# EAGLE board Eagle_LEDCUBE2 (EAGLE 6.5.0)
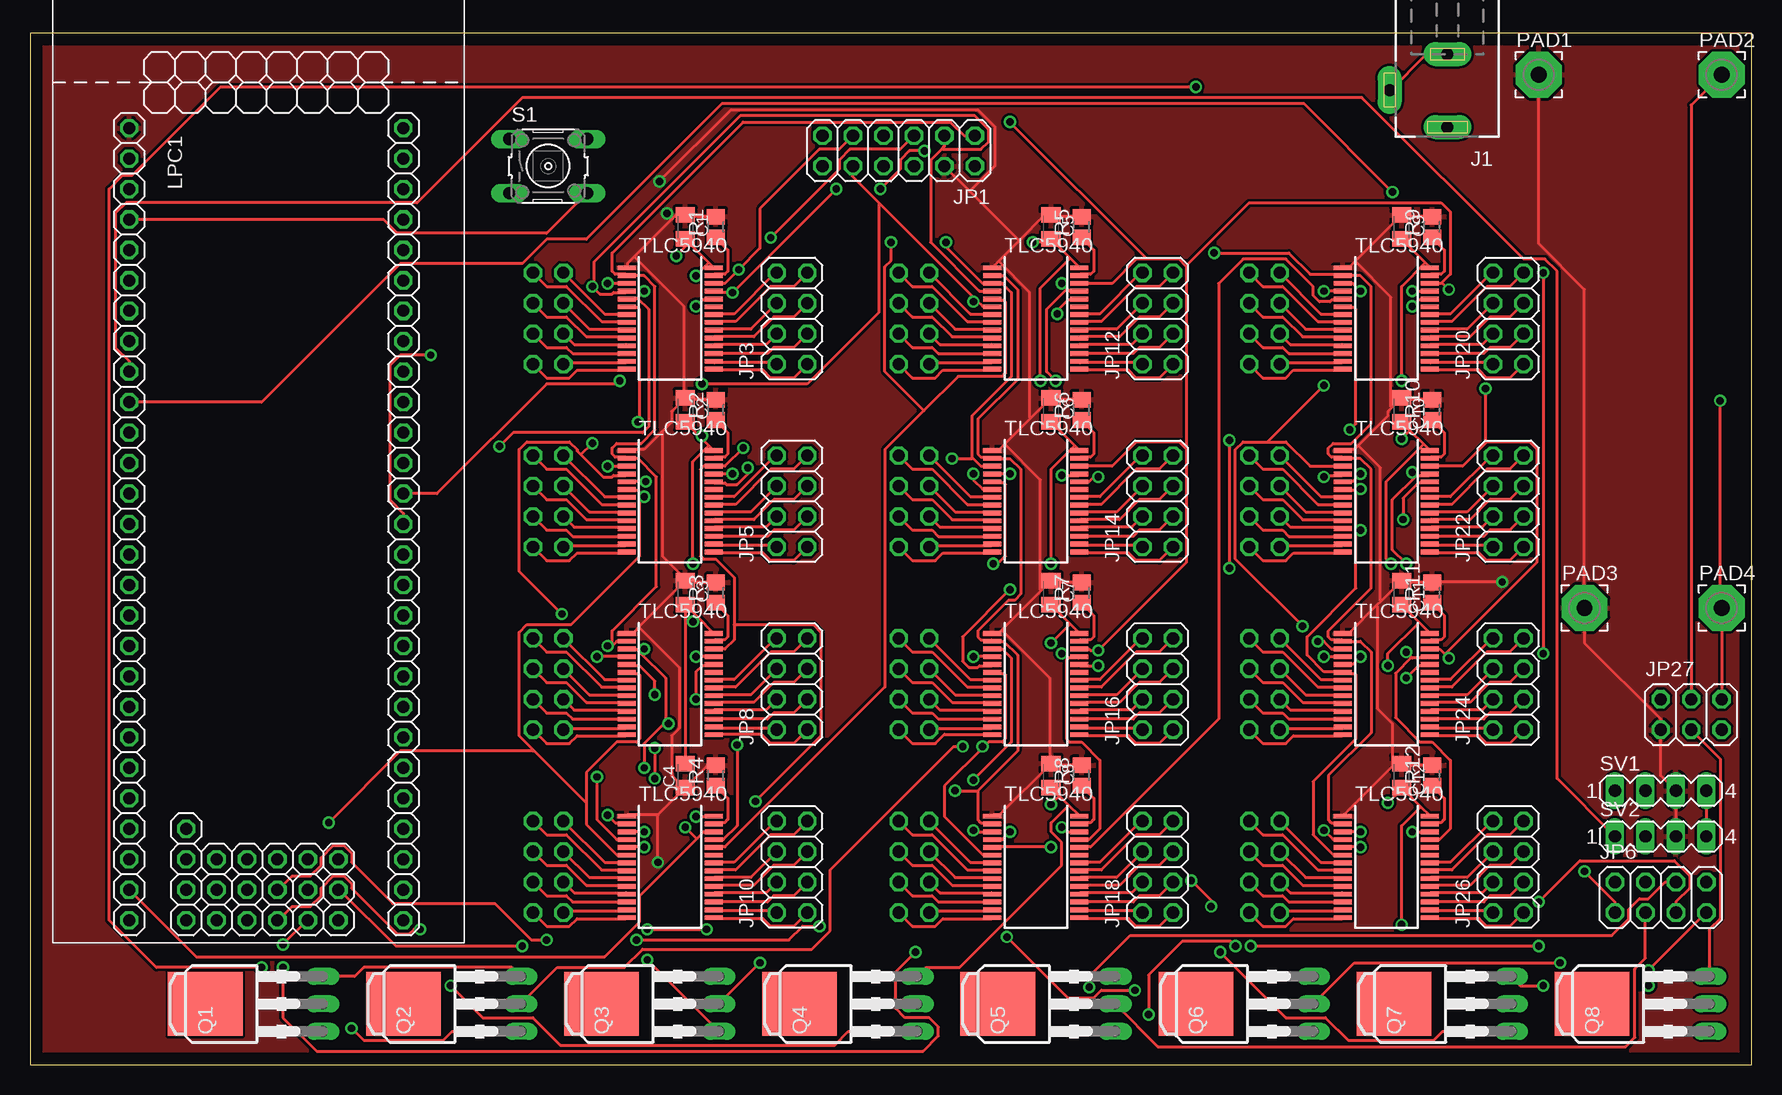
[diagram p6: board, top side]
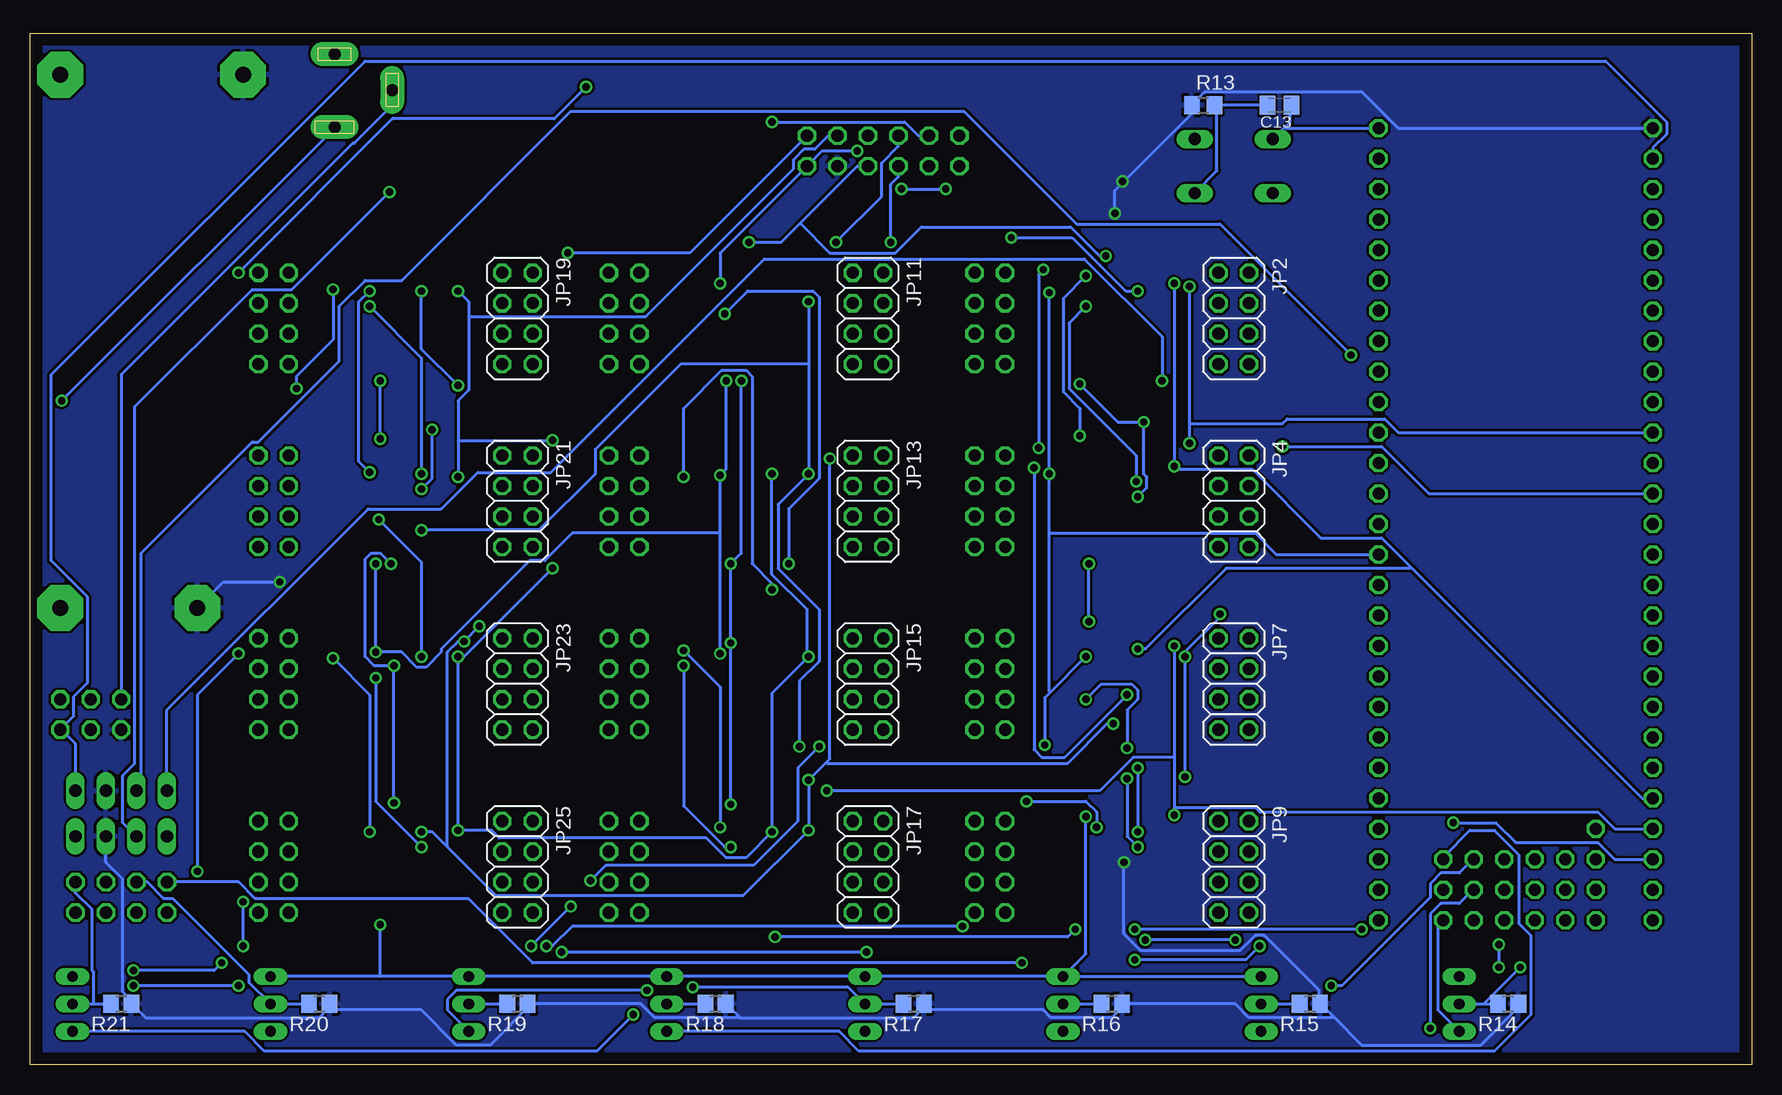
[diagram p7: board, bottom side, seen from below]

Size 143.49 x 86.03 mm. Coordinates in mm from the lower left corner, seen from the top.
Outline: 0,0 143.49,0 143.49,86.03 0,86.03 0,0
Copper layers (1*16): Top 0.035mm / dielectric 1.5mm / Bottom 0.035mm
Design rules "default": minimum track width 10mil, minimum drill 24mil, track to track 8mil, track to pad 8mil, pad to pad 8mil, via to via 8mil, smd to smd 8mil, copper to edge 40mil, drill to drill 8mil, minimum pad ring 10mil, minimum via ring 8mil, stop-mask expansion 4mil, vias tented up to drill 0mil, thermal gap 10mil

## Footprints (pad centres in the part's own frame; a part is rotated, then mirrored left to right if it is on the bottom)
C0805K = smd 1.3 x 1.6: 1 -1,0; 2 1,0
IC-SSOP28 = smd 0.4 x 1.5: 1 -4.225,-3.625; 2 -3.575,-3.625; 3 -2.925,-3.625; 4 -2.275,-3.625; 5 -1.625,-3.625; 6 -0.975,-3.625; 7 -0.325,-3.625; 8 0.325,-3.625; 9 0.975,-3.625; 10 1.625,-3.625; 11 2.275,-3.625; 12 2.925,-3.625; 13 3.575,-3.625; 14 4.225,-3.625; 15 4.225,3.625; 16 3.575,3.625; 17 2.925,3.625; 18 2.275,3.625; 19 1.625,3.625; 20 0.975,3.625; 21 0.325,3.625; 22 -0.325,3.625; 23 -0.975,3.625; 24 -1.625,3.625; 25 -2.275,3.625; 26 -2.925,3.625; 27 -3.575,3.625; 28 -4.225,3.625
DCJ0202 = drill 1 pad 2 long: 1 0,3.1; 2 4.8,0; 3 0,-3
2X06 = drill 1.016 octagon: 1 -6.35,-1.27; 2 -6.35,1.27; 3 -3.81,-1.27; 4 -3.81,1.27; 5 -1.27,-1.27; 6 -1.27,1.27; 7 1.27,-1.27; 8 1.27,1.27; 9 3.81,-1.27; 10 3.81,1.27; 11 6.35,-1.27; 12 6.35,1.27
2X04 = drill 1.016 octagon: 1 -3.81,-1.27; 2 -3.81,1.27; 3 -1.27,-1.27; 4 -1.27,1.27; 5 1.27,-1.27; 6 1.27,1.27; 7 3.81,-1.27; 8 3.81,1.27
2X03 = drill 1.016 octagon: 1 -2.54,-1.27; 2 -2.54,1.27; 3 0,-1.27; 4 0,1.27; 5 2.54,-1.27; 6 2.54,1.27
LPCXPRESSO_LPC1769 = drill 1 octagon: 1 33.655,-5.715; 2 36.195,-5.715; 3 38.735,-5.715; 4 41.275,-5.715; 5 43.815,-5.715; 6 46.355,-5.715; 7 48.895,-5.715; 8 51.435,-5.715; 9 53.975,-5.715; 10 56.515,-5.715; 11 59.055,-5.715; 12 61.595,-5.715; 13 64.135,-5.715; 14 66.675,-5.715; 15 69.215,-5.715; 16 71.755,-5.715; 17 74.295,-5.715; 18 76.835,-5.715; 19 79.375,-5.715; 20 81.915,-5.715; 21 84.455,-5.715; 22 86.995,-5.715; 23 89.535,-5.715; 24 92.075,-5.715; 25 94.615,-5.715; 26 97.155,-5.715; 27 99.695,-5.715; 28 33.655,17.145; 29 36.195,17.145; 30 38.735,17.145; 31 41.275,17.145; 32 43.815,17.145; 33 46.355,17.145; 34 48.895,17.145; 35 51.435,17.145; 36 53.975,17.145; 37 56.515,17.145; 38 59.055,17.145; 39 61.595,17.145; 40 64.135,17.145; 41 66.675,17.145; 42 69.215,17.145; 43 71.755,17.145; 44 74.295,17.145; 45 76.835,17.145; 46 79.375,17.145; 47 81.915,17.145; 48 84.455,17.145; 49 86.995,17.145; 50 89.535,17.145; 51 92.075,17.145; 52 94.615,17.145; 53 97.155,17.145; 54 99.695,17.145; 55 92.075,-0.965; 56 94.615,-0.965; 57 97.155,-0.965; 58 99.695,-0.965; 59 94.615,1.575; 60 97.155,1.575; 61 99.695,1.575; 62 94.615,4.115; 63 97.155,4.115; 64 99.695,4.115; 65 94.615,6.655; 66 97.155,6.655; 67 99.695,6.655; 68 94.615,9.195; 69 97.155,9.195; 70 99.695,9.195; 71 94.615,11.735; 72 97.155,11.735; 73 99.695,11.735
3,81/1,3 = drill 1.321 pad 3.81 octagon: 1 0,0
TO251AA = drill 0.889 long: 1 -2.286,-5.334; 2 0,-5.334; 3 2.286,-5.334 | smd 5.334 x 6.223: 4 0,4.445
R0805 = smd 1.3 x 1.5: 1 -0.85,0; 2 0.85,0
R0805' = smd 1.3 x 1.5: 1 -0.95,0; 2 0.95,0
B3F-10XX = drill 1.016 long: 1 -3.251,2.261; 2 3.251,2.261; 3 -3.251,-2.261; 4 3.251,-2.261
MA04-1 = drill 1.016 long: 1 -3.81,0; 2 -1.27,0; 3 1.27,0; 4 3.81,0

## Placement (x,y rotation side)
C1  [C0805K]  54.61,69.85 270 top
C2  [C0805K]  54.61,54.61 270 top
C3  [C0805K]  54.61,39.37 270 top
C4  [C0805K]  54.61,24.13 90 top
C5  [C0805K]  85.09,69.85 270 top
C6  [C0805K]  85.09,54.61 270 top
C7  [C0805K]  85.09,39.37 270 top
C8  [C0805K]  85.09,24.13 270 top
C9  [C0805K]  114.3,69.85 270 top
C10  [C0805K]  114.3,54.61 270 top
C11  [C0805K]  114.3,39.37 270 top
C12  [C0805K]  114.3,24.13 270 top
C13  [C0805K]  39.37,80.01 180 bottom
IC1  [IC-SSOP28]  53.34,62.23 270 top
IC2  [IC-SSOP28]  53.34,46.99 270 top
IC3  [IC-SSOP28]  53.34,31.75 270 top
IC4  [IC-SSOP28]  53.34,16.51 270 top
IC5  [IC-SSOP28]  83.82,62.23 270 top
IC6  [IC-SSOP28]  83.82,46.99 270 top
IC7  [IC-SSOP28]  83.82,31.75 270 top
IC8  [IC-SSOP28]  83.82,16.51 270 top
IC9  [IC-SSOP28]  113.03,62.23 270 top
IC10  [IC-SSOP28]  113.03,46.99 270 top
IC11  [IC-SSOP28]  113.03,31.75 270 top
IC12  [IC-SSOP28]  113.03,16.51 270 top
J1  DCJ0202  [DCJ0202]  118.11,81.28 180 top
JP1  [2X06]  72.39,76.2 180 top
JP2  [2X04]  43.18,62.23 270 bottom
JP3  [2X04]  63.5,62.23 90 top
JP4  [2X04]  43.18,46.99 270 bottom
JP5  [2X04]  63.5,46.99 90 top
JP6  [2X04]  135.89,13.97 0 top
JP7  [2X04]  43.18,31.75 270 bottom
JP8  [2X04]  63.5,31.75 90 top
JP9  [2X04]  43.18,16.51 270 bottom
JP10  [2X04]  63.5,16.51 90 top
JP11  [2X04]  73.66,62.23 270 bottom
JP12  [2X04]  93.98,62.23 90 top
JP13  [2X04]  73.66,46.99 270 bottom
JP14  [2X04]  93.98,46.99 90 top
JP15  [2X04]  73.66,31.75 270 bottom
JP16  [2X04]  93.98,31.75 90 top
JP17  [2X04]  73.66,16.51 270 bottom
JP18  [2X04]  93.98,16.51 90 top
JP19  [2X04]  102.87,62.23 270 bottom
JP20  [2X04]  123.19,62.23 90 top
JP21  [2X04]  102.87,46.99 270 bottom
JP22  [2X04]  123.19,46.99 90 top
JP23  [2X04]  102.87,31.75 270 bottom
JP24  [2X04]  123.19,31.75 90 top
JP25  [2X04]  102.87,16.51 270 bottom
JP26  [2X04]  123.19,16.51 90 top
JP27  [2X03]  138.43,29.21 0 top
LPC1  [LPCXPRESSO_LPC1769]  13.97,111.76 270 top
PAD1  [3,81/1,3]  125.73,82.55 0 top
PAD2  [3,81/1,3]  140.97,82.55 0 top
PAD3  [3,81/1,3]  129.54,38.1 0 top
PAD4  [3,81/1,3]  140.97,38.1 0 top
Q1  SPD30P06P  [TO251AA]  19.05,5.08 90 top
Q2  SPD30P06P  [TO251AA]  35.56,5.08 90 top
Q3  SPD30P06P  [TO251AA]  52.07,5.08 90 top
Q4  SPD30P06P  [TO251AA]  68.58,5.08 90 top
Q5  SPD30P06P  [TO251AA]  85.09,5.08 90 top
Q6  SPD30P06P  [TO251AA]  101.6,5.08 90 top
Q7  SPD30P06P  [TO251AA]  118.11,5.08 90 top
Q8  SPD30P06P  [TO251AA]  134.62,5.08 90 top
R1  2.2k  [R0805]  57.15,69.85 90 top
R2  2.2k  [R0805]  57.15,54.61 90 top
R3  2.2k  [R0805]  57.15,39.37 90 top
R4  2.2k  [R0805]  57.15,24.13 90 top
R5  2.2k  [R0805]  87.63,69.85 90 top
R6  2.2k  [R0805]  87.63,54.61 90 top
R7  2.2k  [R0805]  87.63,39.37 90 top
R8  2.2k  [R0805]  87.63,24.13 90 top
R9  2.2k  [R0805]  116.84,69.85 90 top
R10  2.2k  [R0805]  116.84,54.61 90 top
R11  2.2k  [R0805]  116.84,39.37 90 top
R12  2.2k  [R0805]  116.84,24.13 90 top
R13  [R0805']  45.72,80.01 0 bottom
R14  [R0805]  20.32,5.08 180 bottom
R15  [R0805]  36.83,5.08 180 bottom
R16  [R0805]  53.34,5.08 180 bottom
R17  [R0805]  69.85,5.08 180 bottom
R18  [R0805]  86.36,5.08 180 bottom
R19  [R0805]  102.87,5.08 180 bottom
R20  [R0805]  119.38,5.08 180 bottom
R21  [R0805]  135.89,5.08 180 bottom
S1  [B3F-10XX]  43.18,74.93 0 top
SV1  [MA04-1]  135.89,22.86 0 top
SV2  [MA04-1]  135.89,19.05 0 top

## Tracks (layer width: path | path; a pad name or v marks a point on that pad's centre or on a via)
2A1
  Top 0.254: JP11.1 78.36,62.61 80.14,62.61 IC5.7
2A2
  Top 0.254: JP11.2 73.53,64.9 75.18,64.9 78.11,61.98 80.14,61.98 IC5.8
2A3
  Top 0.254: JP11.3 77.09,61.34 80.14,61.34 IC5.9
2A4
  Top 0.254: JP11.4 73.53,62.36 75.18,62.36 76.83,60.71 80.14,60.71 IC5.10
2A5
  Top 0.254: JP11.5 75.82,60.07 80.14,60.07 IC5.11
2A6
  Top 0.254: JP11.6 73.53,59.82 75.18,59.82 75.69,59.31 80.14,59.31 IC5.12
2A7
  Top 0.254: JP11.7 75.06,58.55 80.14,58.55 IC5.13
2A8
  Top 0.254: JP11.8 73.53,57.28 75.44,57.28 76.07,57.91 80.14,57.91 IC5.14
2A9
  Top 0.254: JP12.1 94.11,57.28 92.2,57.28 91.57,57.91 87.5,57.91 IC5.15
2A10
  Top 0.254: JP12.2 92.58,58.55 87.5,58.55 IC5.16
2A11
  Top 0.254: JP12.3 94.11,59.82 92.46,59.82 91.95,59.31 87.5,59.31 IC5.17
2A12
  Top 0.254: JP12.4 91.82,60.07 87.5,60.07 IC5.18
2A13
  Top 0.254: JP12.5 94.11,62.36 92.46,62.36 90.8,60.71 87.5,60.71 IC5.19
2A14
  Top 0.254: JP12.6 90.55,61.34 87.5,61.34 IC5.20
2A15
  Top 0.254: JP12.7 94.11,64.9 92.2,64.9 89.28,61.98 87.5,61.98 IC5.21
2A16
  Top 0.254: JP12.8 92.58,66.04 89.15,62.61 87.5,62.61 IC5.22
2B1
  Top 0.254: JP13.1 78.36,47.37 80.14,47.37 IC6.7
2B2
  Top 0.254: JP13.2 73.53,49.66 75.18,49.66 78.11,46.74 80.14,46.74 IC6.8
2B3
  Top 0.254: JP13.3 77.09,46.1 80.14,46.1 IC6.9
2B4
  Top 0.254: JP13.4 73.53,47.12 75.18,47.12 76.83,45.47 80.14,45.47 IC6.10
2B5
  Top 0.254: JP13.5 75.82,44.83 80.14,44.83 IC6.11
2B6
  Top 0.254: JP13.6 73.53,44.58 75.18,44.58 75.69,44.07 80.14,44.07 IC6.12
2B7
  Top 0.254: JP13.7 75.06,43.31 80.14,43.31 IC6.13
2B8
  Top 0.254: JP13.8 73.53,42.04 75.44,42.04 76.07,42.67 80.14,42.67 IC6.14
2B9
  Top 0.254: JP14.1 94.11,42.04 92.2,42.04 91.57,42.67 87.5,42.67 IC6.15
2B10
  Top 0.254: JP14.2 92.58,43.31 87.5,43.31 IC6.16
2B11
  Top 0.254: JP14.3 94.11,44.58 92.46,44.58 91.95,44.07 87.5,44.07 IC6.17
2B12
  Top 0.254: JP14.4 91.82,44.83 87.5,44.83 IC6.18
2B13
  Top 0.254: JP14.5 94.11,47.12 92.46,47.12 90.8,45.47 87.5,45.47 IC6.19
2B14
  Top 0.254: JP14.6 90.55,46.1 87.5,46.1 IC6.20
2B15
  Top 0.254: JP14.7 94.11,49.66 92.2,49.66 89.28,46.74 87.5,46.74 IC6.21
2B16
  Top 0.254: JP14.8 92.58,50.8 89.15,47.37 87.5,47.37 IC6.22
2C1
  Top 0.254: JP15.1 78.36,32.13 80.14,32.13 IC7.7
2C2
  Top 0.254: JP15.2 73.53,34.42 75.18,34.42 78.11,31.5 80.14,31.5 IC7.8
2C3
  Top 0.254: JP15.3 77.09,30.86 80.14,30.86 IC7.9
2C4
  Top 0.254: JP15.4 73.53,31.88 75.18,31.88 76.83,30.23 80.14,30.23 IC7.10
2C5
  Top 0.254: JP15.5 75.82,29.59 80.14,29.59 IC7.11
2C6
  Top 0.254: JP15.6 73.53,29.34 75.18,29.34 75.69,28.83 80.14,28.83 IC7.12
2C7
  Top 0.254: JP15.7 75.06,28.07 80.14,28.07 IC7.13
2C8
  Top 0.254: JP15.8 73.53,26.8 75.44,26.8 76.2,27.56 80.14,27.56 IC7.14
2C9
  Top 0.254: JP16.1 94.11,26.8 92.2,26.8 91.57,27.43 87.5,27.43 IC7.15
2C10
  Top 0.254: JP16.2 92.58,28.07 87.5,28.07 IC7.16
2C11
  Top 0.254: JP16.3 94.11,29.34 92.46,29.34 91.95,28.83 87.5,28.83 IC7.17
2C12
  Top 0.254: JP16.4 91.82,29.59 87.5,29.59 IC7.18
2C13
  Top 0.254: JP16.5 94.11,31.88 92.46,31.88 90.8,30.23 87.5,30.23 IC7.19
2C14
  Top 0.254: JP16.6 90.55,30.86 87.5,30.86 IC7.20
2C15
  Top 0.254: JP16.7 94.11,34.42 92.2,34.42 89.28,31.5 87.5,31.5 IC7.21
2C16
  Top 0.254: JP16.8 92.58,35.56 89.15,32.13 87.5,32.13 IC7.22
2D1
  Top 0.254: JP17.1 78.36,16.89 80.14,16.89 IC8.7
2D2
  Top 0.254: JP17.2 73.53,19.18 75.18,19.18 78.11,16.26 80.14,16.26 IC8.8
2D3
  Top 0.254: JP17.3 77.09,15.62 80.14,15.62 IC8.9
2D4
  Top 0.254: JP17.4 73.53,16.64 75.18,16.64 76.83,14.99 80.14,14.99 IC8.10
2D5
  Top 0.254: JP17.5 75.82,14.35 80.14,14.35 IC8.11
2D6
  Top 0.254: JP17.6 73.53,14.1 75.18,14.1 75.69,13.59 80.14,13.59 IC8.12
2D7
  Top 0.254: JP17.7 75.06,12.83 80.14,12.83 IC8.13
2D8
  Top 0.254: JP17.8 73.53,11.56 75.44,11.56 76.07,12.19 80.14,12.19 IC8.14
2D9
  Top 0.254: JP18.1 94.11,11.56 92.2,11.56 91.57,12.19 87.5,12.19 IC8.15
2D10
  Top 0.254: JP18.2 92.58,12.83 87.5,12.83 IC8.16
2D11
  Top 0.254: JP18.3 94.11,14.1 92.46,14.1 91.95,13.59 87.5,13.59 IC8.17
2D12
  Top 0.254: JP18.4 91.82,14.35 87.5,14.35 IC8.18
2D13
  Top 0.254: JP18.5 94.11,16.64 92.46,16.64 90.8,14.99 87.5,14.99 IC8.19
2D14
  Top 0.254: JP18.6 90.55,15.62 87.5,15.62 IC8.20
2D15
  Top 0.254: JP18.7 94.11,19.18 92.2,19.18 89.28,16.26 87.5,16.26 IC8.21
2D16
  Top 0.254: JP18.8 92.58,20.32 89.15,16.89 87.5,16.89 IC8.22
2SIN  (via drill 0.61)
  Top 0.254: 74.49,54.55 77.34,57.4 81.03,57.4 81.28,57.66 81.28,63.63 81.15,63.75 80.26,63.75 IC5.5 | 74.49,54.55 71.25,51.31 71.25,31.5 57.91,18.16 57.02,18.16 IC4.24 | v71.75,68.58 71.75,67.06 71.25,66.55 71.25,57.79 74.49,54.55
  Bottom 0.254: JP1.8 71.12,74.04 71.75,73.41 v71.75,68.58
2SIN_B  (via drill 0.61)
  Top 0.254: v80.26,41.78 80.64,41.78 81.28,42.42 81.28,48.39 81.15,48.51 80.26,48.51 IC6.5 | v85.6,62.61 85.6,62.87 86.49,63.75 87.38,63.75 IC5.24
  Bottom 0.254: v80.26,41.78 80.26,46.36 77.72,48.9 77.72,64.01 78.23,64.52 83.69,64.52 v85.6,62.61
2SIN_C  (via drill 0.61)
  Top 0.254: v81.66,39.62 77.72,35.69 77.72,33.66 78.23,33.15 78.99,33.15 79.12,33.27 80.14,33.27 IC7.5 | v89.03,49.02 88.65,49.02 88.27,48.64 87.5,48.64 IC6.24
  Bottom 0.254: v81.66,39.62 81.66,40.13 83.31,41.78 83.31,57.4 83.82,57.91 85.85,57.91 89.03,54.74 v89.03,49.02
2SIN_D  (via drill 0.61)
  Top 0.254: v85.09,18.16 80.26,18.16 IC8.5 | v89.03,33.27 87.5,33.27 IC7.24
  Bottom 0.254: v85.09,18.16 85.6,18.16 89.03,21.59 v89.03,33.27
3.3V
  Bottom 0.254: 38.93,78.17 39.88,77.22 S1.1 | 38.93,78.17 38.48,78.61 38.48,80.01 C13.1 | LPC1.28 38.86,78.1 38.93,78.17
3A1
  Top 0.254: JP19.1 107.57,62.61 109.35,62.61 IC9.7
3A2
  Top 0.254: JP19.2 102.74,64.9 104.39,64.9 107.31,61.98 109.35,61.98 IC9.8
3A3
  Top 0.254: JP19.3 106.3,61.34 109.35,61.34 IC9.9
3A4
  Top 0.254: JP19.4 102.74,62.36 104.39,62.36 106.05,60.71 109.35,60.71 IC9.10
3A5
  Top 0.254: JP19.5 105.03,60.07 109.35,60.07 IC9.11
3A6
  Top 0.254: JP19.6 102.74,59.82 104.39,59.82 104.9,59.31 109.35,59.31 IC9.12
3A7
  Top 0.254: JP19.7 104.27,58.55 109.35,58.55 IC9.13
3A8
  Top 0.254: JP19.8 102.74,57.28 104.65,57.28 105.28,57.91 109.35,57.91 IC9.14
3A9
  Top 0.254: JP20.1 123.32,57.28 121.41,57.28 120.78,57.91 116.71,57.91 IC9.15
3A10
  Top 0.254: JP20.2 121.79,58.55 116.71,58.55 IC9.16
3A11
  Top 0.254: JP20.3 123.32,59.82 121.67,59.82 121.16,59.31 116.71,59.31 IC9.17
3A12
  Top 0.254: JP20.4 121.03,60.07 116.71,60.07 IC9.18
3A13
  Top 0.254: JP20.5 123.32,62.36 121.67,62.36 120.01,60.71 116.71,60.71 IC9.19
3A14
  Top 0.254: JP20.6 119.76,61.34 116.71,61.34 IC9.20
3A15
  Top 0.254: JP20.7 123.32,64.9 121.41,64.9 118.49,61.98 116.71,61.98 IC9.21
3A16
  Top 0.254: JP20.8 121.79,66.04 118.36,62.61 116.71,62.61 IC9.22
3B1
  Top 0.254: JP21.1 107.57,47.37 109.35,47.37 IC10.7
3B2
  Top 0.254: JP21.2 102.74,49.66 104.39,49.66 107.31,46.74 109.35,46.74 IC10.8
3B3
  Top 0.254: JP21.3 106.3,46.1 109.35,46.1 IC10.9
3B4
  Top 0.254: JP21.4 102.74,47.12 104.39,47.12 106.05,45.47 109.35,45.47 IC10.10
3B5
  Top 0.254: JP21.5 105.03,44.83 109.35,44.83 IC10.11
3B6
  Top 0.254: JP21.6 102.74,44.58 104.39,44.58 104.9,44.07 109.35,44.07 IC10.12
3B7
  Top 0.254: JP21.7 104.27,43.31 109.35,43.31 IC10.13
3B8
  Top 0.254: JP21.8 102.74,42.04 104.65,42.04 105.28,42.67 109.35,42.67 IC10.14
3B9
  Top 0.254: JP22.1 123.32,42.04 121.41,42.04 120.78,42.67 116.71,42.67 IC10.15
3B10
  Top 0.254: JP22.2 121.79,43.31 116.71,43.31 IC10.16
3B11
  Top 0.254: JP22.3 123.32,44.58 121.67,44.58 121.16,44.07 116.71,44.07 IC10.17
3B12
  Top 0.254: JP22.4 121.03,44.83 116.71,44.83 IC10.18
3B13
  Top 0.254: JP22.5 123.32,47.12 121.67,47.12 120.01,45.47 116.71,45.47 IC10.19
3B14
  Top 0.254: JP22.6 119.76,46.1 116.71,46.1 IC10.20
3B15
  Top 0.254: JP22.7 123.32,49.66 121.41,49.66 118.49,46.74 116.71,46.74 IC10.21
3B16
  Top 0.254: JP22.8 121.79,50.8 118.36,47.37 116.71,47.37 IC10.22
3C1
  Top 0.254: JP23.1 107.57,32.13 109.35,32.13 IC11.7
3C2
  Top 0.254: JP23.2 102.74,34.42 104.39,34.42 107.31,31.5 109.35,31.5 IC11.8
3C3
  Top 0.254: JP23.3 106.3,30.86 109.35,30.86 IC11.9
3C4
  Top 0.254: JP23.4 102.74,31.88 104.39,31.88 106.05,30.23 109.35,30.23 IC11.10
3C5
  Top 0.254: JP23.5 105.03,29.59 109.35,29.59 IC11.11
3C6
  Top 0.254: JP23.6 102.74,29.34 104.39,29.34 104.9,28.83 109.35,28.83 IC11.12
3C7
  Top 0.254: JP23.7 104.27,28.07 109.35,28.07 IC11.13
3C8
  Top 0.254: JP23.8 102.74,26.8 104.65,26.8 105.28,27.43 109.35,27.43 IC11.14
3C9
  Top 0.254: JP24.1 123.32,26.8 121.41,26.8 120.78,27.43 116.71,27.43 IC11.15
3C10
  Top 0.254: JP24.2 121.79,28.07 116.71,28.07 IC11.16
3C11
  Top 0.254: JP24.3 123.32,29.34 121.67,29.34 121.16,28.83 116.71,28.83 IC11.17
3C12
  Top 0.254: JP24.4 121.03,29.59 116.71,29.59 IC11.18
3C13
  Top 0.254: JP24.5 123.32,31.88 121.67,31.88 120.01,30.23 116.71,30.23 IC11.19
3C14
  Top 0.254: JP24.6 119.76,30.86 116.71,30.86 IC11.20
3C15
  Top 0.254: JP24.7 123.32,34.42 121.41,34.42 118.49,31.5 116.71,31.5 IC11.21
3C16
  Top 0.254: JP24.8 121.79,35.56 118.36,32.13 116.71,32.13 IC11.22
3D1
  Top 0.254: JP25.1 107.57,16.89 109.35,16.89 IC12.7
3D2
  Top 0.254: JP25.2 102.74,19.18 104.39,19.18 107.31,16.26 109.35,16.26 IC12.8
3D3
  Top 0.254: JP25.3 106.3,15.62 109.35,15.62 IC12.9
3D4
  Top 0.254: JP25.4 102.74,16.64 104.39,16.64 106.05,14.99 109.35,14.99 IC12.10
3D5
  Top 0.254: JP25.5 105.03,14.35 109.35,14.35 IC12.11
3D6
  Top 0.254: JP25.6 102.74,14.1 104.39,14.1 104.9,13.59 109.35,13.59 IC12.12
3D7
  Top 0.254: JP25.7 104.27,12.83 109.35,12.83 IC12.13
3D8
  Top 0.254: JP25.8 102.74,11.56 104.65,11.56 105.28,12.19 109.35,12.19 IC12.14
3D9
  Top 0.254: JP26.1 123.32,11.56 121.41,11.56 120.78,12.19 116.71,12.19 IC12.15
3D10
  Top 0.254: JP26.2 121.79,12.83 116.71,12.83 IC12.16
3D11
  Top 0.254: JP26.3 123.32,14.1 121.67,14.1 121.16,13.59 116.71,13.59 IC12.17
3D12
  Top 0.254: JP26.4 121.03,14.35 116.71,14.35 IC12.18
3D13
  Top 0.254: JP26.5 123.32,16.64 121.67,16.64 120.01,14.99 116.71,14.99 IC12.19
3D14
  Top 0.254: JP26.6 119.76,15.62 116.71,15.62 IC12.20
3D15
  Top 0.254: JP26.7 123.32,19.18 121.41,19.18 118.49,16.26 116.71,16.26 IC12.21
3D16
  Top 0.254: JP26.8 121.79,20.32 118.36,16.89 116.71,16.89 IC12.22
3SIN
  Top 0.254: IC8.24 87.5,18.16 88.39,18.16 99.06,28.83 99.06,65.15 101.09,67.18 104.65,67.18 106.93,64.9 106.93,64.14 107.44,63.63 108.33,63.63 108.46,63.75 109.35,63.75 IC9.5
3SIN_B  (via drill 0.61)
  Top 0.254: v110.87,49.28 110.24,48.64 109.47,48.64 IC10.5 | v115.19,63.25 115.7,63.75 116.59,63.75 IC9.24
  Bottom 0.254: v110.87,49.28 110.87,58.93 v115.19,63.25
3SIN_C  (via drill 0.61)
  Top 0.254: v110.87,34.04 110.24,33.4 109.47,33.4 IC11.5 | v114.43,45.47 114.43,47.24 115.7,48.51 116.59,48.51 IC10.24
  Bottom 0.254: v110.87,34.04 110.87,41.91 v114.43,45.47
3SIN_D  (via drill 0.61)
  Top 0.254: v110.87,18.16 109.47,18.16 IC12.5 | v114.68,32.26 115.7,33.27 116.59,33.27 IC11.24
  Bottom 0.254: v110.87,18.16 114.68,21.97 v114.68,32.26
A1
  Top 0.254: JP2.1 47.88,62.61 49.66,62.61 IC1.7
A2
  Top 0.254: JP2.2 43.05,64.9 44.7,64.9 47.62,61.98 49.66,61.98 IC1.8
A3
  Top 0.254: JP2.3 46.61,61.34 49.66,61.34 IC1.9
A4
  Top 0.254: JP2.4 43.05,62.36 44.7,62.36 46.36,60.71 49.66,60.71 IC1.10
A5
  Top 0.254: JP2.5 45.34,60.07 49.66,60.07 IC1.11
A6
  Top 0.254: JP2.6 43.05,59.82 44.7,59.82 45.21,59.31 49.66,59.31 IC1.12
A7
  Top 0.254: JP2.7 44.58,58.55 49.66,58.55 IC1.13
A8
  Top 0.254: JP2.8 43.05,57.28 44.96,57.28 45.59,57.91 49.66,57.91 IC1.14
A9
  Top 0.254: JP3.1 63.63,57.28 61.72,57.28 61.09,57.91 57.02,57.91 IC1.15
A10
  Top 0.254: JP3.2 62.1,58.55 57.02,58.55 IC1.16
A11
  Top 0.254: JP3.3 63.63,59.82 61.98,59.82 61.47,59.31 57.02,59.31 IC1.17
A12
  Top 0.254: JP3.4 61.34,60.07 57.02,60.07 IC1.18
A13
  Top 0.254: JP3.5 63.63,62.36 61.98,62.36 60.33,60.71 57.02,60.71 IC1.19
A14
  Top 0.254: JP3.6 60.07,61.34 57.02,61.34 IC1.20
A15
  Top 0.254: JP3.7 63.63,64.9 61.72,64.9 58.8,61.98 57.02,61.98 IC1.21
A16
  Top 0.254: JP3.8 62.1,66.04 58.67,62.61 57.02,62.61 IC1.22
B1
  Top 0.254: JP4.1 47.88,47.37 49.66,47.37 IC2.7
B2
  Top 0.254: JP4.2 43.05,49.66 44.7,49.66 47.62,46.74 49.66,46.74 IC2.8
B3
  Top 0.254: JP4.3 46.61,46.1 49.66,46.1 IC2.9
B4
  Top 0.254: JP4.4 43.05,47.12 44.7,47.12 46.36,45.47 49.66,45.47 IC2.10
B5
  Top 0.254: JP4.5 45.34,44.83 49.66,44.83 IC2.11
B6
  Top 0.254: JP4.6 43.05,44.58 44.7,44.58 45.21,44.07 49.66,44.07 IC2.12
B7
  Top 0.254: JP4.7 44.58,43.31 49.66,43.31 IC2.13
B8
  Top 0.254: JP4.8 43.05,42.04 44.96,42.04 45.59,42.67 49.66,42.67 IC2.14
B9
  Top 0.254: JP5.1 63.63,42.04 61.72,42.04 61.09,42.67 57.02,42.67 IC2.15
B10
  Top 0.254: JP5.2 62.1,43.31 57.02,43.31 IC2.16
B11
  Top 0.254: JP5.3 63.63,44.58 61.98,44.58 61.47,44.07 57.02,44.07 IC2.17
B12
  Top 0.254: JP5.4 61.34,44.83 57.02,44.83 IC2.18
B13
  Top 0.254: JP5.5 63.63,47.12 61.98,47.12 60.33,45.47 57.02,45.47 IC2.19
B14
  Top 0.254: JP5.6 60.07,46.1 57.02,46.1 IC2.20
B15
  Top 0.254: JP5.7 63.63,49.66 61.72,49.66 58.8,46.74 57.02,46.74 IC2.21
B16
  Top 0.254: JP5.8 62.1,50.8 58.67,47.37 57.02,47.37 IC2.22
BLANK  (via drill 0.61)
  Top 0.254: IC12.2 109.35,20.19 108.46,20.19 108.2,20.45 108.2,24.13 111.76,27.69 111.76,34.42 110.87,35.31 109.47,35.31 IC11.2 109.35,35.43 108.46,35.43 108.2,35.69 108.2,36.2 111.76,39.75 111.76,49.66 110.87,50.55 109.47,50.55 IC10.2 109.35,50.67 108.46,50.67 108.2,50.93 108.2,51.44 108.58,51.82 110.11,51.82 111.76,53.47 111.76,64.9 110.87,65.79 109.47,65.79 IC9.2 109.35,65.91 106.68,65.91 104.9,67.69 v98.68,67.69 | 78.99,22.86 78.99,20.45 79.25,20.19 80.14,20.19 IC8.2 | 78.99,22.86 82.3,26.16 82.3,34.16 81.15,35.31 80.26,35.31 IC7.2 80.14,35.43 79.25,35.43 78.99,35.69 78.99,36.2 81.53,38.74 82.04,38.74 82.55,39.24 82.55,49.66 81.66,50.55 80.26,50.55 IC6.2 80.14,50.67 79.25,50.67 78.99,50.93 78.99,53.85 82.3,57.15 82.3,64.64 81.15,65.79 80.26,65.79 IC5.2 | v48.13,20.83 48.77,20.19 49.66,20.19 IC4.2 | IC3.2 49.66,35.31 48.89,35.31 48.51,34.93 v48.13,34.93 48.51,35.05 48.51,36.2 52.2,39.88 52.2,49.02 50.67,50.55 49.78,50.55 IC2.2 49.66,50.67 48.77,50.67 48.51,50.93 48.51,51.44 48.89,51.82 50.93,51.82 52.07,52.96 52.07,64.9 51.18,65.79 49.78,65.79 IC1.2 49.66,65.91 48.77,65.91 48.51,66.17 48.51,67.69 59.44,78.61 76.71,78.61 77.85,77.47 JP1.1 | v77.09,22.86 78.99,22.86
  Bottom 0.254: v48.13,34.93 48.13,25.65 | 48.13,25.65 48.13,21.46 | 48.13,21.46 v48.13,20.83 | LPC1.24 11.43,19.68 12.83,21.08 41.02,21.08 41.4,21.46 48.13,21.46 | v77.09,22.86 54.36,22.86 51.56,25.65 48.13,25.65 | v98.68,67.69 88.52,67.69 JP1.1
C1
  Top 0.254: JP7.1 47.88,32.13 49.66,32.13 IC3.7
C2
  Top 0.254: JP7.2 43.05,34.42 44.7,34.42 47.62,31.5 49.66,31.5 IC3.8
C3
  Top 0.254: JP7.3 46.61,30.86 49.66,30.86 IC3.9
C4
  Top 0.254: JP7.4 43.05,31.88 44.7,31.88 46.36,30.23 49.66,30.23 IC3.10
C5
  Top 0.254: JP7.5 45.34,29.59 49.66,29.59 IC3.11
C6
  Top 0.254: JP7.6 43.05,29.34 44.7,29.34 45.21,28.83 49.66,28.83 IC3.12
C7
  Top 0.254: JP7.7 44.58,28.07 49.66,28.07 IC3.13
C8
  Top 0.254: JP7.8 43.05,26.8 44.96,26.8 45.59,27.43 49.66,27.43 IC3.14
C9
  Top 0.254: JP8.1 63.63,26.8 61.72,26.8 60.96,27.56 57.02,27.56 IC3.15
C10
  Top 0.254: JP8.2 62.1,28.07 57.02,28.07 IC3.16
C11
  Top 0.254: JP8.3 63.63,29.34 61.98,29.34 61.47,28.83 57.02,28.83 IC3.17
C12
  Top 0.254: JP8.4 61.34,29.59 57.02,29.59 IC3.18
C13
  Top 0.254: JP8.5 63.63,31.88 61.98,31.88 60.33,30.23 57.02,30.23 IC3.19
C14
  Top 0.254: JP8.6 60.07,30.86 57.02,30.86 IC3.20
C15
  Top 0.254: JP8.7 63.63,34.42 61.72,34.42 58.8,31.5 57.02,31.5 IC3.21
C16
  Top 0.254: JP8.8 62.1,35.56 58.67,32.13 57.02,32.13 IC3.22
D1
  Top 0.254: JP9.1 47.88,16.89 49.66,16.89 IC4.7
D2
  Top 0.254: JP9.2 43.05,19.18 44.7,19.18 47.62,16.26 49.66,16.26 IC4.8
D3
  Top 0.254: JP9.3 46.61,15.62 49.66,15.62 IC4.9
D4
  Top 0.254: JP9.4 43.05,16.64 44.7,16.64 46.36,14.99 49.66,14.99 IC4.10
D5
  Top 0.254: JP9.5 45.34,14.35 49.66,14.35 IC4.11
D6
  Top 0.254: JP9.6 43.05,14.1 44.7,14.1 45.21,13.59 49.66,13.59 IC4.12
D7
  Top 0.254: JP9.7 44.58,12.83 49.66,12.83 IC4.13
D8
  Top 0.254: JP9.8 43.05,11.56 44.96,11.56 45.59,12.19 49.66,12.19 IC4.14
D9
  Top 0.254: JP10.1 63.63,11.56 61.72,11.56 61.09,12.19 57.02,12.19 IC4.15
D10
  Top 0.254: JP10.2 62.1,12.83 57.02,12.83 IC4.16
D11
  Top 0.254: JP10.3 63.63,14.1 61.98,14.1 61.47,13.59 57.02,13.59 IC4.17
D12
  Top 0.254: JP10.4 61.34,14.35 57.02,14.35 IC4.18
D13
  Top 0.254: JP10.5 63.63,16.64 61.98,16.64 60.33,14.99 57.02,14.99 IC4.19
D14
  Top 0.254: JP10.6 60.07,15.62 57.02,15.62 IC4.20
D15
  Top 0.254: JP10.7 63.63,19.18 61.72,19.18 58.8,16.26 57.02,16.26 IC4.21
D16
  Top 0.254: JP10.8 62.1,20.32 58.67,16.89 57.02,16.89 IC4.22
DCPRG  (via drill 0.61)
  Top 0.254: 55.56,18.86 50.8,14.1 50.8,11.94 47.88,9.02 13.84,9.02 LPC1.26 | 55.56,18.86 56.13,19.43 56.9,19.43 IC4.26 | 58.67,36.7 58.67,40.64 57.15,42.16 56.13,42.16 55.88,42.42 55.88,49.66 56.13,49.91 56.9,49.91 IC2.26 57.02,49.91 57.91,49.91 v59.44,51.44 | 58.67,36.7 58.67,35.43 57.91,34.67 57.02,34.67 IC3.26 | JP1.9 67.44,76.33 65.79,76.33 60.83,71.37 60.83,68.07 v59.05,66.29 57.91,65.15 57.02,65.15 IC1.26 | v115.19,19.43 116.59,19.43 IC12.26 | IC11.26 116.71,34.67 117.47,34.67 v118.24,33.91 117.98,34.29 125.6,41.91 125.6,51.31 124.97,51.94 121.41,51.94 121.35,51.88 | 121.35,51.88 119.38,49.91 116.71,49.91 IC10.26 | v85.98,19.81 86.36,19.43 87.38,19.43 IC8.26 | IC7.26 87.5,34.67 88.27,34.67 88.39,34.54 v89.03,34.54 96.39,41.91 96.39,51.31 96.33,51.37 | 96.33,51.37 95.76,51.94 92.2,51.94 90.17,49.91 87.5,49.91 IC6.26 | 93.09,67.18 95.76,67.18 96.33,66.61 | 93.09,67.18 92.2,67.18 90.17,65.15 87.5,65.15 IC5.26 | 96.33,66.61 96.39,66.55 96.39,51.44 96.33,51.37 | 117.67,65.21 118.36,65.91 118.36,71.12 117.6,71.88 101.6,71.88 96.33,66.61 | 117.67,65.21 117.6,65.15 116.71,65.15 IC9.26 | v121.28,56.39 121.28,51.94 121.35,51.88 | 117.67,65.21 v118.24,64.64 | 93.09,67.18 v81.66,78.61 | v54.61,19.81 55.56,18.86 | v60.45,21.97 65.91,27.43 65.91,36.07 65.28,36.7 58.67,36.7
  Bottom 0.254: v59.44,51.44 59.44,65.91 v59.05,66.29 | v115.19,19.43 115.19,30.86 v118.24,33.91 | v85.98,19.81 85.98,31.5 v89.03,34.54 | v121.28,56.39 121.28,57.4 118.24,60.45 v118.24,64.64 | JP1.9 69.47,77.47 70.61,78.61 v81.66,78.61 | v54.61,19.81 54.61,21.08 55.5,21.97 v60.45,21.97
GND  (via drill 0.61)
  Top 0.254: 82.42,68.71 84.45,70.74 85.09,70.74 | 82.42,68.71 80.71,66.99 | 80.71,66.99 80.26,66.55 IC5.1 | 85.09,70.74 87.63,70.74 R5.2 | 85.09,70.74 C5.1 | 82.42,68.71 78.3,72.83 | 78.3,72.83 JP1.4 | 83.38,53.91 85.09,55.63 C6.1 85.09,55.5 87.63,55.5 R6.2 | 83.38,53.91 81.22,51.75 | 81.22,51.75 80.77,51.31 80.26,51.31 IC6.1 | IC8.1 80.26,20.83 80.77,20.83 85.09,25.15 C8.1 | R8.2 87.63,25.02 85.09,25.02 C8.1 | 84.26,39.56 85.09,40.39 C7.1 85.09,40.26 87.63,40.26 R7.2 | 84.26,39.56 80.96,36.26 | 80.96,36.26 80.77,36.07 80.26,36.07 IC7.1 | 80.96,36.26 84.96,32.26 84.96,25.15 C8.1 | 81.22,51.75 84.2,48.77 84.2,39.62 84.26,39.56 | 80.71,66.99 83.31,64.39 83.31,53.98 83.38,53.91 | 52.32,20.83 49.78,20.83 IC4.1 | 54.61,23.11 52.32,20.83 | 54.61,23.11 56.39,24.89 57.15,24.89 R4.2 | 54.61,23.11 C4.1 54.48,23.11 53.47,24.13 53.47,27.43 54.1,28.07 54.1,33.15 50.74,36.51 | 50.74,36.51 54.61,40.39 C3.1 | 50.74,36.51 50.29,36.07 49.78,36.07 IC3.1 | R3.2 57.15,40.26 54.61,40.26 C3.1 | 52.64,52.77 53.47,53.59 53.47,54.48 54.61,55.63 C2.1 | 52.64,52.77 51.18,51.31 49.78,51.31 IC2.1 | R2.2 57.15,55.5 54.61,55.5 C2.1 | 53.53,70.55 53.72,70.74 54.61,70.74 | 53.53,70.55 50.36,67.37 | 50.36,67.37 49.78,66.8 49.78,66.55 IC1.1 | 54.61,70.74 57.15,70.74 R1.2 | 54.61,70.74 C1.1 | 53.53,70.55 v53.09,70.99 | 50.36,67.37 54.48,63.25 54.48,55.63 C2.1 | C3.1 54.48,40.39 54.48,40.64 52.7,42.42 52.7,52.71 52.64,52.77 | 78.3,72.83 80.39,74.93 80.39,78.23 78.99,79.63 58.42,79.63 v52.45,73.66 | 110.43,66.99 114.3,70.87 C9.1 114.3,70.74 116.84,70.74 R9.2 | 110.43,66.99 109.98,66.55 109.47,66.55 IC9.1 | 110.68,51.62 113.16,54.1 113.16,54.48 113.47,54.8
  Top 0.254: 110.68,51.62 110.36,51.31 109.47,51.31 IC10.1 | 113.47,54.8 114.3,55.63 C10.1 114.3,55.5 116.84,55.5 R10.2 | 114.3,25.02 113.66,25.02 109.47,20.83 IC12.1 | 114.3,25.02 116.84,25.02 R12.2 | 114.3,25.02 C12.1 113.54,25.02 113.54,28.45 112.27,29.72 112.27,38.23 112.2,38.29 | 112.59,38.67 114.3,40.39 C11.1 114.3,40.26 116.84,40.26 | 112.59,38.67 112.2,38.29 | 112.2,38.29 109.98,36.07 109.47,36.07 IC11.1 | 110.68,51.62 112.52,49.78 112.52,38.74 112.59,38.67 | 110.43,66.99 113.41,64.01 113.41,54.86 113.47,54.8 | SV2.3 SV1.3 135.89,24.13 JP27.1 135.89,28.83 129.54,35.18 PAD3.1 129.54,64.64 125.73,68.45 PAD1.1 | v122.68,40.26 116.84,40.26 | 116.84,40.26 R11.2 | v52.32,16.89 52.32,20.83
  Bottom 0.254: 46.74,80.01 46.74,79.25 52.39,73.6 | 52.39,73.6 53.09,72.9 v53.09,70.99 | LPC1.1 29.46,78.1 32.51,81.15 45.59,81.15 46.74,80.01 | 46.74,80.01 R13.1 | v52.45,73.66 52.39,73.6 | SV2.3 137.16,16.89 135.76,15.49 135.76,6.1 135.13,5.46 135.13,5.08 R21.1 135,5.08 133.86,3.94 119.38,3.94 118.62,4.7 118.62,5.08 R20.1 118.62,4.57 110.87,4.57 107.95,1.65 105.16,1.65 101.73,5.08 | 84.39,4 85.47,5.08 R18.1 | 84.39,4 84.33,3.94 69.85,3.94 69.09,4.7 69.09,5.08 R17.1 69.09,4.57 59.05,4.57 58.42,3.94 53.34,3.94 52.2,5.08 | 101.73,5.08 92.58,5.08 91.44,3.94 84.45,3.94 84.39,4 | 101.73,5.08 R19.1 101.98,5.08 | 34.86,4 35.94,5.08 R15.1 36.07,5.08 36.07,6.22 40.64,10.79 41.4,10.79 42.67,9.53 50.93,9.53 52.32,10.92 v52.32,16.89 | 34.86,4 32.51,1.65 22.61,1.65 19.56,4.7 19.56,5.08 R14.1 | 52.2,5.08 43.05,5.08 41.91,3.94 34.92,3.94 34.86,4 | 52.2,5.08 R16.1 52.45,5.08 | v122.68,40.26 127.38,40.26 PAD3.1
  pour Bottom: 0,85.09 0,0 143.51,0 143.51,85.09 143.51,86.36 0,86.36
  pour Top: 0,85.09 0,0 143.51,0 143.51,85.09 143.51,86.36 0,86.36
GND_IN
  Top 0.254: J1.3 118.11,84.2 116.33,84.2 113.41,81.28 J1.2
  Bottom 0.254: JP27.2 135.89,57.53 116.59,76.83 116.46,76.83 113.41,79.88 113.41,81.28 J1.2
GSCLK  (via drill 0.61)
  Top 0.254: v58.93,26.67 58.93,19.94 57.78,18.8 57.02,18.8 IC4.25 | v55.5,34.04 56.9,34.04 IC3.25 | v58.55,49.28 57.02,49.28 IC2.25 | IC1.25 57.02,64.39 v58.55,64.39 v67.18,73.02 | 115.19,33.91 116.59,33.91 IC11.25 | 115.19,33.91 115.06,33.91 113.79,32.64 113.79,28.96 115.82,26.92 116.84,26.92 118.36,25.4 118.36,19.68 117.47,18.8 116.71,18.8 IC12.25 | 115.51,49.09 113.54,47.12 113.54,42.93 v114.68,41.78 | 115.51,49.09 115.57,49.15 116.59,49.15 IC10.25 | 115.19,33.91 v114.68,34.42 | v115.19,64.52 116.59,64.52 IC9.25 | 115.51,49.09 v115.19,49.4 | v85.98,65.15 86.42,64.71 | 86.42,64.71 86.61,64.52 87.38,64.52 IC5.25 | 86.42,33.85 86.49,33.91 87.38,33.91 IC7.25 | 86.42,33.85 86.36,33.78 86.36,27.18 86.61,26.92 87.63,26.92 89.15,25.4 89.15,19.68 88.27,18.8 87.5,18.8 IC8.25 | v85.98,49.15 87.38,49.15 IC6.25 | 86.42,33.85 v85.98,34.29 | 86.42,64.71 84.71,62.99 84.71,57.79 v85.47,57.02 | v70.87,73.02 72.52,74.68 72.52,75.44 73.28,76.2 v74.55,76.2
  Bottom 0.254: v58.93,26.67 58.93,30.61 58.48,31.05 | v55.5,34.04 58.48,31.05 | 58.55,44.32 58.55,31.11 58.48,31.05 | 58.55,44.32 v58.55,49.28 v58.55,64.39 | LPC1.42 39.62,42.55 41.4,44.32 58.55,44.32 | v114.68,41.78 v114.68,34.42 112.52,34.42 111.25,33.15 110.49,33.15 109.22,34.42 109.22,34.67 101.85,42.04 100.58,42.04 98.3,44.32 85.98,44.32 | v115.19,64.52 116.08,63.63 116.08,50.29 v115.19,49.4 | v85.98,65.15 85.98,67.69 JP1.2 77.47,76.2 v74.55,76.2 | v85.98,34.29 85.98,44.32 | 85.98,44.32 v85.98,49.15 85.47,49.66 v85.47,57.02 | v70.87,73.02 v67.18,73.02
L1  (via drill 0.61)
  Top 0.254: JP6.1 132.08,13.59 v129.54,16.13 | v126.11,66.04 v126.11,34.29 | v97.16,81.53 15.88,81.53 8.51,74.17 7.75,74.17 6.6,73.02 6.6,12.06 10.54,8.13 v19.3,8.13
  Bottom 0.254: Q1.2 22.35,5.08 | 22.35,5.08 R14.2 | v129.54,16.13 129.54,30.86 v126.11,34.29 | v126.11,66.04 113.28,78.87 99.82,78.87 v97.16,81.53 | 22.35,5.08 v19.3,8.13
L2  (via drill 0.61)
  Top 0.254: Q3.2 v60.83,8.51
  Bottom 0.254: Q3.2 R16.2 | JP6.2 126.11,15.24 124.71,13.84 106.93,13.84 101.6,8.51 v60.83,8.51
L3
  Top 0.254: JP6.3 134.62,8.89 133.73,8 133.73,2.29 132.97,1.52 93.98,1.52 Q5.2
  Bottom 0.254: Q5.2 R18.2
L4
  Bottom 0.254: R20.2 Q7.2 125.22,6.86 125.22,7.49 131.57,13.84 132.33,13.84 133.73,15.24 JP6.4
L5  (via drill 0.61)
  Top 0.254: JP6.5 137.16,13.59 138.3,14.73 138.3,15.75 137.03,17.02 129.16,17.02 v125.73,13.59 | v101.73,9.91 v125.73,9.91 | v98.42,13.21 98.42,13.72 v96.77,15.37 | v77.72,26.54 76.96,26.54 66.67,16.26 66.67,11.18 65.15,9.65 51.05,9.65 49.53,8.13 43.94,8.13 Q2.2
  Bottom 0.254: Q2.2 R15.2 | v125.73,9.91 v125.73,13.59 | v98.42,13.21 v101.73,9.91 | v96.77,15.37 95.5,16.64 83.19,16.64 79.5,20.32 79.5,24.77 v77.72,26.54
L6  (via drill 0.61)
  Top 0.254: JP6.6 136.27,15.24 134.87,13.84 134.11,13.84 133.22,12.95 133.22,12.19 131.83,10.79 91.69,10.79 88.27,7.37 v88.27,6.48
  Bottom 0.254: R17.2 Q4.2 75.31,6.48 v88.27,6.48
L7  (via drill 0.61)
  Top 0.254: v134.87,7.87 JP6.7 | v127.51,8.51 110.36,8.51 Q6.2
  Bottom 0.254: Q6.2 R19.2 | v134.87,7.87 128.14,7.87 v127.51,8.51
L8
  Bottom 0.254: Q8.2 138.18,5.08 | 138.18,5.08 R21.2 | JP6.8 139.7,14.35 138.3,12.95 138.3,7.87 138.18,7.75 138.18,5.08
LAYER1
  Bottom 0.254: Q1.1 26.16,4.57 26.16,11.68 25.78,12.06 LPC1.73
LAYER2  (via drill 0.61)
  Top 0.254: v51.44,8.76 Q3.1 | v41.02,9.91 30.48,9.91 25.78,14.61 LPC1.72
  Bottom 0.254: v51.44,8.76 42.16,8.76 v41.02,9.91
LAYER3
  Bottom 0.254: Q5.1 76.07,2.79 74.42,1.14 21.46,1.14 18.41,4.19 18.41,10.79 19.43,11.81 19.43,17.53 21.46,19.56 23.49,19.56 25.65,17.4 25.65,17.14 LPC1.71
LAYER4  (via drill 0.61)
  Top 0.254: Q7.1 117.73,2.79 116.97,2.03 109.86,2.03 107.95,3.94 104.65,3.94 v99.19,9.4 | v73.79,9.4 72.14,7.75 72.14,4.7 72.9,3.94 74.93,3.94 75.69,3.17 75.69,2.41 74.42,1.14 23.88,1.14 21.08,3.94 v21.08,8.13 | v21.08,10.03 23.11,12.06 LPC1.70
  Bottom 0.254: v73.79,9.4 v99.19,9.4 | v21.08,10.03 v21.08,8.13
LAYER5  (via drill 0.61)
  Top 0.254: Q2.1 35.18,2.79 34.42,2.03 27.81,2.03 v26.8,3.05
  Bottom 0.254: v26.8,3.05 26.8,12.57 25.91,13.46 24.38,13.46 23.24,14.61 LPC1.69
LAYER6  (via drill 0.61)
  Top 0.254: Q4.1 68.2,2.79 67.06,1.65 44.2,1.65 41.91,3.94 37.72,3.94 v35.05,6.6
  Bottom 0.254: v35.05,6.6 34.16,6.6 26.8,13.97 26.8,15.11 25.91,16 24.38,16 23.24,17.14 LPC1.68
LAYER7  (via drill 0.61)
  Top 0.254: v92.08,6.22 89.28,6.22 88.65,5.59 86.49,5.59 v81.41,10.67 | v51.44,11.3 v56.39,11.3 | v32.51,11.3 32,11.3 31.62,10.92 30.61,10.92 26.8,14.73 26.8,15.11 26.16,15.75 25.27,15.75 24.26,14.73 24.26,14.1 23.37,13.21 21.84,13.21 20.7,12.06 LPC1.67
  Bottom 0.254: Q6.1 108.71,4.57 108.71,5.46 107.95,6.22 v92.08,6.22 | v81.41,10.67 57.02,10.67 v56.39,11.3 | v32.51,11.3 v51.44,11.3
LAYER8  (via drill 0.61)
  Top 0.254: v93.22,4.19 93.22,7.49 96.01,10.29 100.08,10.29 v100.46,9.91 | v65.79,11.56 64.39,11.56 63.25,10.41 v50.55,10.41 | v43.05,10.41 41.78,10.41 38.73,13.46 30.23,13.46 26.8,16.89 26.8,17.65 26.16,18.29 25.27,18.29 24.26,17.27 24.26,16.64 23.37,15.75 21.84,15.75 20.7,14.61 LPC1.66
  Bottom 0.254: Q8.1 125.6,2.79 123.95,1.14 96.27,1.14 v93.22,4.19 | v100.46,9.91 99.95,9.91 98.3,11.56 v65.79,11.56 | v43.05,10.41 v50.55,10.41
N$1
  Top 0.254: IC5.27 87.5,65.91 88.39,65.91 88.65,66.17 88.65,67.94 87.63,68.96 R5.1
N$2
  Top 0.254: IC6.27 87.5,50.67 88.39,50.67 88.65,50.93 88.65,52.71 87.63,53.72 R6.1
N$3
  Top 0.254: IC7.27 87.5,35.43 88.39,35.43 88.65,35.69 88.65,37.47 87.63,38.48 R7.1
N$4
  Top 0.254: IC8.27 87.5,20.19 88.39,20.19 88.65,20.45 88.65,22.22 87.63,23.24 R8.1
N$5
  Top 0.254: IC1.27 57.02,65.91 57.91,65.91 58.17,66.17 58.17,67.94 57.15,68.96 R1.1
N$6
  Top 0.254: IC9.27 116.71,65.91 117.6,65.91 117.86,66.17 117.86,67.94 116.84,68.96 R9.1
N$7
  Top 0.254: IC10.27 116.71,50.67 117.6,50.67 117.86,50.93 117.86,52.71 116.84,53.72 R10.1
N$8
  Top 0.254: IC11.27 116.71,35.43 117.6,35.43 117.86,35.69 117.86,37.47 116.84,38.48 R11.1
N$9
  Top 0.254: IC12.27 116.71,20.19 117.6,20.19 117.86,20.45 117.86,22.22 116.84,23.24 R12.1
N$16
  Top 0.254: IC2.27 57.02,50.67 57.91,50.67 58.17,50.93 58.17,52.71 57.15,53.72 R2.1
N$26
  Top 0.254: IC3.27 57.02,35.43 57.91,35.43 58.17,35.69 58.17,37.47 57.15,38.48 R3.1
N$35
  Top 0.254: IC4.27 57.02,20.19 57.91,20.19 58.17,20.45 58.17,22.22 57.15,23.24 R4.1
RESET_N
  Top 0.254: LPC1.4 29.46,70.48 30.61,69.34 43.05,69.34 46.36,72.64 S1.4
  Bottom 0.254: C13.2 44.58,80.01 | 44.58,80.01 R13.2 44.7,80.01 | 44.58,80.01 44.58,74.55 46.36,72.77 S1.4
RX2  (via drill 0.61)
  Top 0.254: LPC1.41 31.12,45.97 29.97,47.12 29.97,58.29 30.86,59.18 v33.4,59.18
  Bottom 0.254: v33.4,59.18 44.32,70.1 56.26,70.1 65.66,79.5 98.42,79.5 112.52,65.41 115.57,65.41 117.73,63.25 117.73,58.67 124.46,51.94 124.97,51.94 134.24,42.67 134.24,23.24 SV1.2
RX3  (via drill 0.61)
  Top 0.254: LPC1.10 19.3,55.25 30.86,66.8 41.02,66.8 43.05,68.83 46.36,68.83 57.66,80.14 106.17,80.14 v113.54,72.77
  Bottom 0.254: v113.54,72.77 121.67,64.64 124.97,64.64 134.75,54.86 134.75,25.15 135.76,24.13 135.76,20.19 SV2.2
SCLK  (via drill 0.61)
  Top 0.254: v47.24,24 47.24,20.45 48.89,18.8 49.66,18.8 IC4.4 | v47.24,34.04 49.66,34.04 IC3.4 | 45.91,50.86 45.59,51.18 45.59,51.31 44.96,51.94 41.4,51.94 40.77,51.31 40.77,41.15 v44.32,37.59 | 45.91,50.86 47.75,49.02 48.51,49.02 48.64,49.15 49.66,49.15 IC2.4 | 45.91,50.86 v46.86,51.82 | IC1.4 49.66,64.39 48.64,64.39 48.51,64.26 47.5,64.26 v46.86,64.9 46.99,64.9 46.99,66.93 59.18,79.12 78.74,79.12 79.88,77.98 79.88,76.96 79.25,76.33 76.07,76.33 76.01,76.39 | v81.66,19.43 81.03,18.8 80.26,18.8 IC8.4 | v78.61,34.04 80.14,34.04 IC7.4 | v81.66,49.28 80.26,49.28 IC6.4 | v107.82,19.56 108.58,18.8 109.35,18.8 IC12.4 | v107.82,34.04 109.35,34.04 IC11.4 | v107.82,49.02 107.95,49.15 109.35,49.15 IC10.4 | v107.82,64.52 109.35,64.52 IC9.4 | 76.01,76.39 76.2,76.58 JP1.3 | 76.01,76.39 75.06,75.44 75.06,68.58 79.12,64.52 80.14,64.52 IC5.4 | v99.95,52.07 v99.95,41.4
  Bottom 0.254: v47.24,24 v47.24,34.04 47.24,34.42 44.32,37.34 v44.32,37.59 | v46.86,51.82 46.86,53.47 | 46.86,53.47 v46.86,64.9 | LPC1.11 29.46,52.71 30.61,53.85 38.73,53.85 39.12,53.47 46.86,53.47 | v81.66,49.28 81.66,40.89 78.74,37.97 78.74,34.04 v78.61,34.04 81.66,30.99 v81.66,19.43 83.82,17.27 85.47,17.27 87.12,18.92 104.39,18.92 105.03,19.56 v107.82,19.56 v107.82,34.04 107.31,34.04 v99.95,41.4 | 107.82,52.07 107.82,55.37 106.93,56.26 106.93,62.36 | 107.82,52.07 v107.82,49.02 | 106.93,62.36 106.93,63.63 v107.82,64.52 | 106.93,62.36 92.2,62.36 79.88,74.68 79.88,75.44 78.99,76.33 78.11,76.33 76.96,77.47 JP1.3 | 107.82,52.07 v99.95,52.07
SIN  (via drill 0.61)
  Top 0.254: v51.18,64.52 50.61,63.95 | 50.61,63.95 50.55,63.88 49.78,63.88 IC1.5 | v61.72,68.96 67.44,74.68 67.44,75.44 68.33,76.33 72.52,76.33 JP1.5 | v39.12,51.56 40.26,52.71 51.05,52.71 51.56,53.21 51.56,62.99 50.61,63.95
  Bottom 0.254: v51.18,64.52 52.2,64.52 56.64,68.96 v61.72,68.96 | LPC1.13 26.92,47.62 30.86,51.56 v39.12,51.56
SIN_B  (via drill 0.61)
  Top 0.254: v51.31,48.64 49.78,48.64 IC2.5 | v55.5,63.25 56.01,63.75 56.9,63.75 IC1.24
  Bottom 0.254: v51.31,48.64 51.31,50.8 56.9,56.39 56.9,61.85 v55.5,63.25
SIN_C  (via drill 0.61)
  Top 0.254: v52.07,30.86 52.07,32 50.8,33.27 49.78,33.27 IC3.5 | v59.82,49.78 59.82,49.28 58.93,48.39 58.04,48.39 57.91,48.51 57.02,48.51 IC2.24
  Bottom 0.254: v52.07,30.86 57.28,25.65 59.18,25.65 59.82,26.29 v59.82,49.78
SIN_D  (via drill 0.61)
  Top 0.254: v51.18,18.16 49.78,18.16 IC4.5 | v52.07,26.42 v52.07,23.88 | v55.5,30.48 55.5,32.77 56.01,33.27 56.9,33.27 IC3.24
  Bottom 0.254: v51.18,18.16 52.07,19.05 v52.07,23.88 | v52.07,26.42 52.07,29.59 51.18,30.48 51.18,31.24 51.69,31.75 54.23,31.75 v55.5,30.48
TX2  (via drill 0.61)
  Top 0.254: LPC1.40 33.91,47.62 43.05,56.77 48.89,56.77 v49.15,57.02
  Bottom 0.254: v49.15,57.02 49.15,60.71 55.63,67.18 82.3,67.18 100.08,49.4 106.17,49.4 109.22,46.36 115.32,46.36 132.08,29.59 SV1.1
TX3
  Top 0.254: LPC1.9 8.25,58.67 7.11,59.82 7.11,70.99 8,71.88 32.26,71.88 41.02,80.64 111,80.64 124.46,67.18 126.24,67.18 127.25,66.17 127.25,23.88 SV2.1
V3_IN
  Top 0.254: JP27.4 138.43,80.01 PAD2.1
V5+
  Top 0.254: SV1.4 SV2.4
  Bottom 0.254: LPC1.2 8.25,76.45 7.11,77.6 7.11,78.61 12.19,83.69 115.57,83.69 141.73,57.53 141.73,42.04 138.68,38.99 138.68,31.88 139.83,30.73 139.83,29.08 JP27.5 140.84,27.94 139.7,26.8 SV1.4
V5_IN  (via drill 0.61)
  Top 0.254: JP27.6 PAD4.1 140.84,38.23 v140.84,55.37
  Bottom 0.254: v140.84,55.37 118.11,78.1 J1.1
VCC  (via drill 0.61)
  Top 0.254: 55.82,52.39 54.61,53.59 C2.2 | 55.82,52.39 56.58,51.62 | 56.58,51.62 56.9,51.31 IC2.28 | 55.63,37.34 54.61,38.35 C3.2 C4.2 | 55.63,37.34 56.9,36.07 IC3.28 | 56.58,51.62 55.25,50.29 v55.25,41.78 | 55.63,37.34 v55.25,36.96 | 56.58,66.87 54.61,68.83 C1.2 54.86,68.45 v53.85,67.44 | 56.58,66.87 56.9,66.55 IC1.28 | 86.68,67.25 85.09,68.83 C5.2 85.22,68.58 v83.57,68.58 | 86.68,67.25 87.38,66.55 IC5.28 | v56.01,52.45 55.88,52.45 55.82,52.39 | 56.58,66.87 v55.5,65.79 | Q1.3 27.05,7.37 27.81,8.13 40.13,8.13 Q2.3 | 87.06,51.62 85.09,53.59 C6.2 | 87.06,51.62 87.38,51.31 IC6.28 | 86.68,36.77 85.09,38.35 C7.2 | 86.68,36.77 87.38,36.07 IC7.28 | 115.89,21.53 114.3,23.11 C12.2 114.3,22.99 v113.16,21.84 | 115.89,21.53 116.59,20.83 IC12.28 | 85.79,22.41 85.09,23.11 C8.2 | 85.79,22.41 86.55,21.65 | 86.55,21.65 87.38,20.83 IC8.28 | v55.5,20.7 56.9,20.7 IC4.28 | 86.55,21.65 85.09,20.19 85.09,19.43 85.98,18.54 85.98,16.64 77.47,8.13 74.68,8.13 Q4.3 | 115.89,21.53 114.3,19.94 v114.3,11.68 | v85.09,35.18 86.68,36.77 | 85.79,22.41 v85.09,21.72 | 87.06,51.62 85.09,49.66 v85.09,41.78 | 86.68,67.25 84.2,64.77 v84.2,57.02 | JP27.3 140.84,25.53 140.84,12.19 139.95,11.3 Q8.3 135.64,7.37 v134.87,6.6 | 116.27,66.87 114.3,68.83 C9.2 | 116.27,66.87 116.59,66.55 IC9.28 | 115,52.9 114.3,53.59 C10.2 | 115,52.9 116.14,51.75 | 116.14,51.75 116.59,51.31 IC10.28 | 115.76,36.89 114.3,38.35 C11.2 | 115.76,36.89 116.59,36.07 IC11.28 | 115.76,36.89 113.16,34.29 v113.16,33.27 | 116.14,51.75 113.03,48.64 113.03,42.16 v113.41,41.78 | 116.27,66.87 114.3,64.9 v114.3,57.02 | 115,52.9 v114.3,52.2 | v126.11,6.6 124.21,6.6 Q7.3
  Bottom 0.254: v55.25,36.96 v55.25,41.78 | JP1.6 74.55,74.93 79.31,70.17 | 79.31,70.17 80.9,68.58 v83.57,68.58 | v53.85,67.44 54.36,67.44 56.77,69.85 69.22,69.85 71.37,67.69 76.83,67.69 79.31,70.17 | v56.01,52.45 56.01,54.74 57.4,56.13 57.4,63.88 v55.5,65.79 | v55.5,20.7 55.5,9.27 Q3.3 | Q3.3 Q4.3 Q5.3 Q6.3 114.3,7.37 | 114.3,7.37 Q7.3 | 114.3,7.37 v114.3,11.68 | v85.09,21.72 v85.09,35.18 v85.09,41.78 84.2,42.67 v84.2,57.02 | Q3.3 Q2.3 | v113.16,21.84 v113.16,33.27 114.81,33.27 115.57,34.04 115.57,42.16 115.06,42.67 114.3,42.67 v113.41,41.78 | v114.3,52.2 v114.3,57.02 | v126.11,6.6 v134.87,6.6
VPRG  (via drill 0.61)
  Top 0.254: 46.36,21.84 46.36,24.38 48.89,26.92 50.55,26.92 50.8,27.18 50.8,32.51 50.67,32.64 49.78,32.64 IC3.6 | 46.36,21.84 46.36,20.07 48.89,17.53 49.66,17.53 IC4.6 | 50.8,47.37 50.8,42.42 45.09,36.7 41.4,36.7 40.77,36.07 40.77,27.43 41.97,26.23 | 50.8,47.37 50.8,47.75 50.67,47.88 49.78,47.88 IC2.6 | 46.36,21.84 41.97,26.23 | v50.67,53.59 50.8,53.72 50.8,62.99 50.67,63.12 49.78,63.12 IC1.6 | 50.8,47.37 v51.18,47.37 | v24.89,20.19 30.86,26.16 41.91,26.16 41.97,26.23 | IC12.6 109.35,17.53 108.58,17.53 106.93,19.18 106.93,23.62 110.49,27.18 110.49,32.51 110.36,32.64 109.47,32.64 IC11.6 109.35,32.77 107.82,32.77 106.43,34.16 106.43,35.69 110.49,39.75 110.49,44.58 | 110.49,44.58 110.49,47.62 | 110.49,47.62 110.49,47.75 110.36,47.88 109.47,47.88 IC10.6 | v109.98,52.96 110.49,53.47 110.49,62.99 110.36,63.12 109.47,63.12 IC9.6 | 110.49,47.62 v110.87,48.01 | 79.44,26.48 79.88,26.92 81.03,26.92 81.28,27.18 81.28,32.51 81.15,32.64 80.26,32.64 IC7.6 | 79.44,26.48 76.2,23.24 76.2,20.7 79.38,17.53 80.14,17.53 IC8.6 | v78.61,49.28 78.61,48.77 79.38,48.01 80.14,48.01 IC6.6 | 78.99,63.63 79.38,63.25 80.14,63.25 IC5.6 | JP1.10 68.58,74.04 70.8,71.82 | 78.99,63.63 70.8,71.82 | 78.99,63.63 v78.61,63.63 | v79.38,26.54 79.44,26.48 | v110.87,44.58 110.49,44.58 | v56.01,56.77 64.77,56.77 70.74,62.74 70.74,71.75 70.8,71.82
  Bottom 0.254: v51.18,47.37 50.42,48.13 50.42,49.02 50.67,49.28 v50.67,53.59 52.83,53.59 v56.01,56.77 | LPC1.25 11.43,17.14 12.83,18.54 19.69,18.54 21.34,20.19 v24.89,20.19 | v109.98,52.96 109.98,48.9 v110.87,48.01 | v78.61,63.63 78.61,58.42 | 78.61,58.42 v78.61,49.28 81.15,46.74 81.15,41.4 77.72,37.97 77.72,33.66 79.38,32 v79.38,26.54 | v110.87,44.58 101.09,44.58 96.39,49.28 96.39,51.31 89.28,58.42 78.61,58.42
XLAT  (via drill 0.61)
  Top 0.254: v51.18,19.43 49.78,19.43 IC4.3 | v51.18,24.77 51.18,26.8 52.89,28.51 | 52.89,28.51 52.96,28.57 52.96,32.26 50.86,34.35 | 50.86,34.35 50.55,34.67 49.78,34.67 IC3.3 | v48.13,49.91 49.66,49.91 IC2.3 | v48.13,65.15 49.66,65.15 IC1.3 | v51.18,34.67 50.86,34.35 | 78.55,50.61 78.49,50.67 78.49,54.1 81.79,57.4 81.79,64.39 81.03,65.15 80.26,65.15 IC5.3 80.14,65.15 79.38,65.15 76.33,68.2 v76.33,68.58 | 78.55,50.61 79.25,49.91 80.14,49.91 IC6.3 | v78.61,19.56 78.74,19.43 80.14,19.43 IC8.3 | v78.61,23.75 81.79,26.92 81.79,33.91 81.03,34.67 80.26,34.67 IC7.3 | v110.87,19.43 109.47,19.43 IC12.3 | v107.31,35.31 107.82,35.31 108.46,34.67 109.35,34.67 IC11.3 | 103.12,51.94 101.09,51.94 100.46,51.31 100.46,42.16 v106.05,36.58 | 103.12,51.94 104.65,51.94 106.68,49.91 109.35,49.91 IC10.3 | v110.87,64.52 110.24,65.15 109.47,65.15 IC9.3 | 103.12,51.94 v107.82,56.64 | v76.83,50.55 78.49,50.55 78.55,50.61 | v53.21,28.45 52.96,28.45 52.89,28.51
  Bottom 0.254: v51.18,24.77 v51.18,19.43 | v48.13,65.15 v48.13,49.91 47.88,49.66 41.66,49.66 35.94,43.94 30.86,43.94 28.38,41.47 | LPC1.23 9.14,22.22 28.38,41.47 | v51.18,34.67 50.55,34.67 43.81,41.4 28.45,41.4 28.38,41.47 | JP1.7 71.12,76.58 72.52,75.18 72.52,72.39 v76.33,68.58 | v110.87,19.43 109.98,19.43 108.78,18.22 | 108.78,18.22 104.65,14.1 84.07,14.1 v78.61,19.56 v78.61,23.75 77.15,25.21 | 108.78,18.22 108.71,18.29 108.71,34.42 107.82,35.31 v107.31,35.31 v106.05,36.58 | v110.87,64.52 110.87,59.69 v107.82,56.64 | v76.83,50.55 76.83,25.53 77.15,25.21 | v53.21,28.45 53.72,28.45 57.02,25.15 77.09,25.15 77.15,25.21